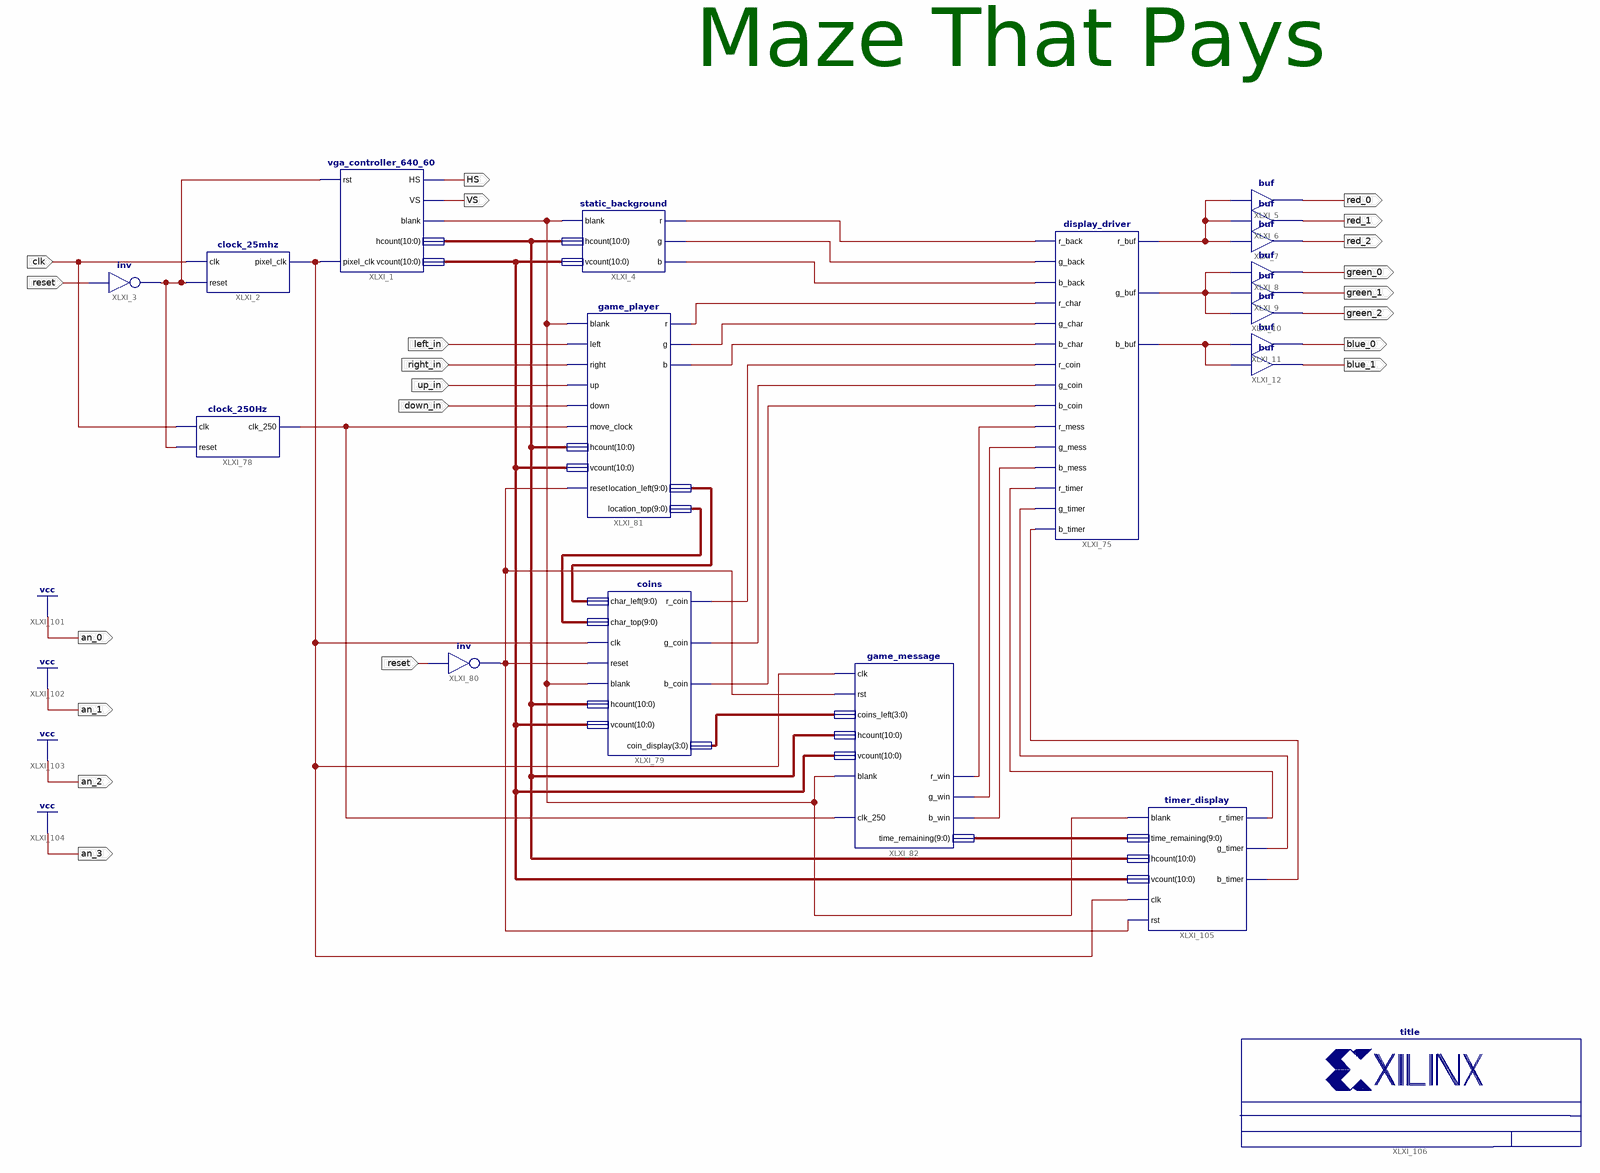
[diagram p0: schematic sheet 1]
// Xilinx ISE schematic maze_that_pays.sch (spartan3e) as structural Verilog: 20 symbols, 20 ports
module maze_that_pays (
  input  clk,
  input  reset,
  input  down_in,
  input  up_in,
  input  right_in,
  input  left_in,
  output HS,
  output VS,
  output red_0,
  output red_1,
  output red_2,
  output blue_1,
  output blue_0,
  output green_0,
  output green_1,
  output green_2,
  output an_0,
  output an_1,
  output an_2,
  output an_3
);

  wire XLXN_22, XLXN_23, XLXN_178, XLXN_179, XLXN_180, XLXN_184, XLXN_189, XLXN_221, XLXN_231, XLXN_232,
       XLXN_233, XLXN_246, XLXN_247, XLXN_248, XLXN_268, XLXN_409, XLXN_410, XLXN_411, XLXN_417, XLXN_505,
       XLXN_507, XLXN_509, XLXN_514;
  wire [3:0] XLXN_269;
  wire [9:0] location_left, location_right, XLXN_478;
  wire [10:0] XLXN_289, XLXN_477;

  title #(.TitleFieldText("Maze That Pays - EGR 426 Project 2"), .NameFieldText("Steven Diemer")) XLXI_106 ();
  static_background XLXI_4 (
    .blank(XLXN_184), .hcount(XLXN_477), .vcount(XLXN_289), .r(XLXN_178), .g(XLXN_179), .b(XLXN_180));
  coins XLXI_79 (
    .clk(XLXN_268), .reset(XLXN_514), .blank(XLXN_184), .hcount(XLXN_477), .vcount(XLXN_289),
    .char_left(location_left), .char_top(location_right), .r_coin(XLXN_231), .g_coin(XLXN_232),
    .b_coin(XLXN_233), .coin_display(XLXN_269));
  not XLXI_3 (XLXN_221, reset);
  clock_250Hz XLXI_78 (.clk(clk), .reset(XLXN_221), .clk_250(XLXN_417));
  vga_controller_640_60 XLXI_1 (
    .rst(XLXN_221), .pixel_clk(XLXN_268), .HS(HS), .VS(VS), .blank(XLXN_184), .hcount(XLXN_477),
    .vcount(XLXN_289));
  not XLXI_80 (XLXN_514, reset);
  game_message XLXI_82 (
    .clk(XLXN_268), .clk_250(XLXN_417), .rst(XLXN_514), .blank(XLXN_184), .coins_left(XLXN_269),
    .hcount(XLXN_477), .vcount(XLXN_289), .r_win(XLXN_409), .g_win(XLXN_410), .b_win(XLXN_411),
    .time_remaining(XLXN_478));
  clock_25mhz XLXI_2 (.clk(clk), .reset(XLXN_221), .pixel_clk(XLXN_268));
  timer_display XLXI_105 (
    .blank(XLXN_184), .hcount(XLXN_477), .vcount(XLXN_289), .time_remaining(XLXN_478), .r_timer(XLXN_505),
    .g_timer(XLXN_507), .b_timer(XLXN_509), .clk(XLXN_268), .rst(XLXN_514));
  buf XLXI_6 (red_1, XLXN_23);
  buf XLXI_7 (red_2, XLXN_23);
  buf XLXI_5 (red_0, XLXN_23);
  buf XLXI_12 (blue_1, XLXN_189);
  buf XLXI_11 (blue_0, XLXN_189);
  buf XLXI_10 (green_2, XLXN_22);
  buf XLXI_9 (green_1, XLXN_22);
  buf XLXI_8 (green_0, XLXN_22);
  game_player XLXI_81 (
    .blank(XLXN_184), .left(left_in), .right(right_in), .up(up_in), .down(down_in), .move_clock(XLXN_417),
    .hcount(XLXN_477), .vcount(XLXN_289), .r(XLXN_246), .g(XLXN_247), .b(XLXN_248),
    .location_left(location_left), .location_top(location_right), .reset(XLXN_514));
  display_driver XLXI_75 (
    .r_back(XLXN_178), .g_back(XLXN_179), .b_back(XLXN_180), .r_char(XLXN_246), .g_char(XLXN_247),
    .b_char(XLXN_248), .r_coin(XLXN_231), .g_coin(XLXN_232), .b_coin(XLXN_233), .r_mess(XLXN_409),
    .g_mess(XLXN_410), .b_mess(XLXN_411), .r_buf(XLXN_23), .g_buf(XLXN_22), .b_buf(XLXN_189),
    .r_timer(XLXN_505), .g_timer(XLXN_507), .b_timer(XLXN_509));

  assign an_0 = 1'b1;
  assign an_1 = 1'b1;
  assign an_2 = 1'b1;
  assign an_3 = 1'b1;

  // Notes on the sheet:
  //   Maze That Pays
endmodule
